# EAGLE design AFM_Power_board__NEW_SMD (EAGLE 9.6.2)
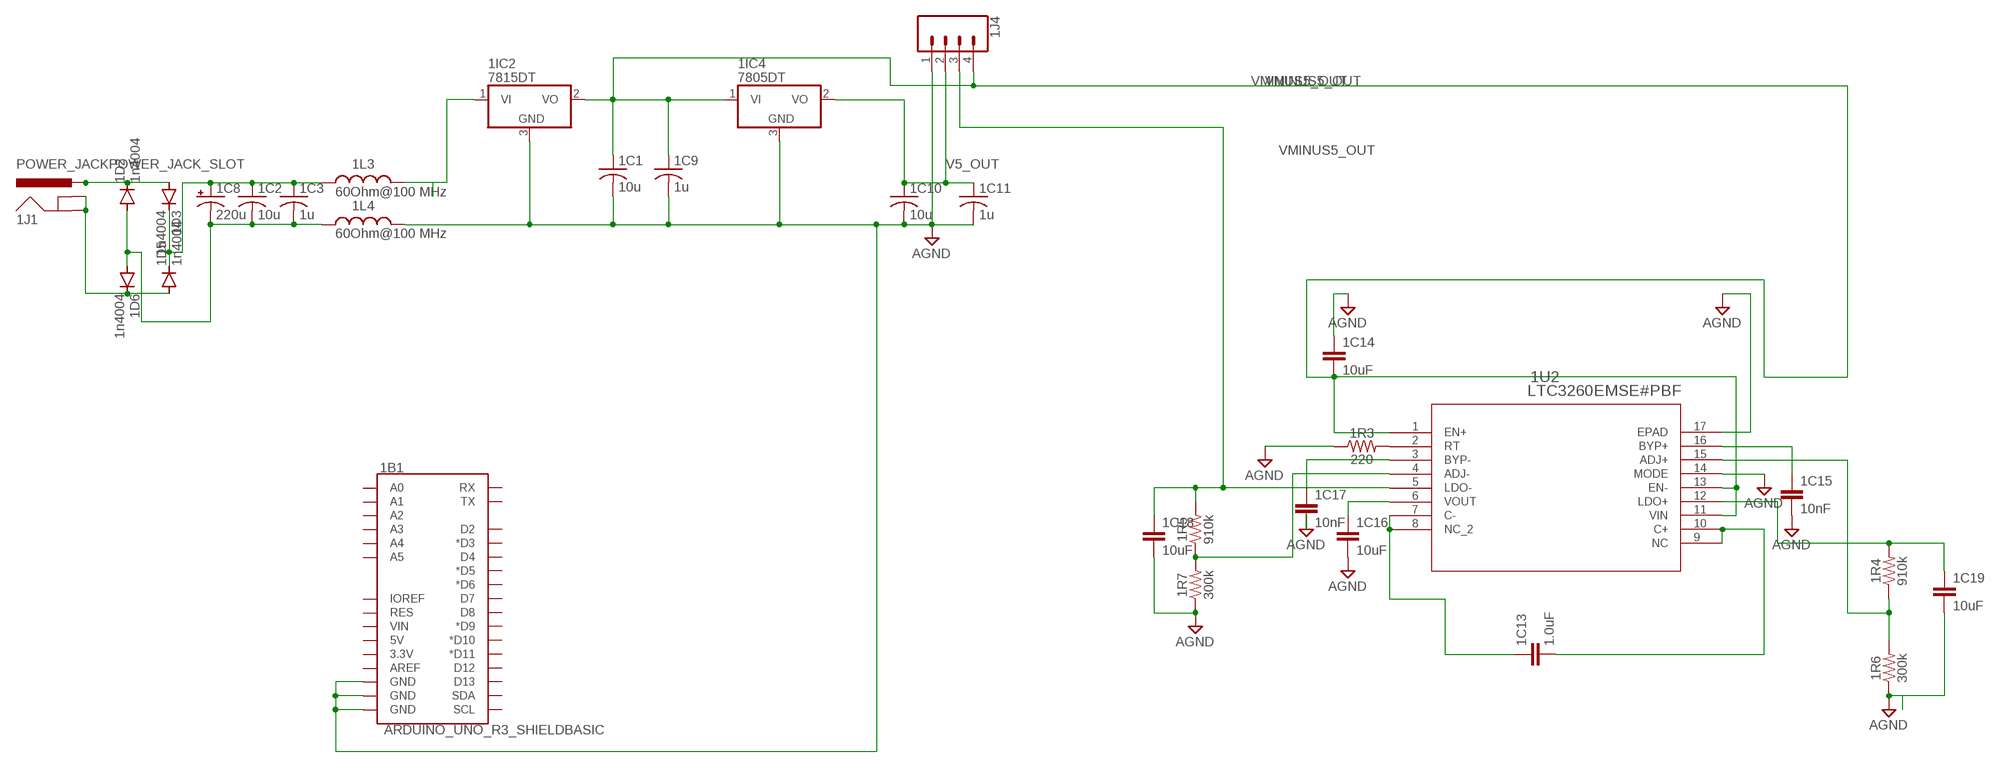
[diagram p0: schematic, sheet 1]

## Parts
1B1  ARDUINO_UNO_R3_SHIELDBASIC  [UNO_R3_SHIELD]
1C1  10u  C-USC0603  [C0603]
1C2  10u  C-USC1210  [C1210]
1C3  1u  C-USC1210  [C1210]
1C8  220u  CAPACITOR-P140CLH-1014  [140CLH-1014]
1C9  1u  C-USC0603  [C0603]
1C10  10u  C-USC0603  [C0603]
1C11  1u  C-USC0603  [C0603]
1C13  1.0uF  1.0UF-0805-25V-(+80/-20%)  [0805]
1C14  10uF  10UF-0805-25V-10%  [0805]
1C15  10nF  10NF-0603-50V-10%  [0603]
1C16  10uF  10UF-0805-25V-10%  [0805]
1C17  10nF  10NF-0603-50V-10%  [0603]
1C18  10uF  10UF-0805-25V-10%  [0805]
1C19  10uF  10UF-0805-25V-10%  [0805]
1D2  1n4004  DIODE-SOD123  [SOD123]
1D3  1n4004  DIODE-SOD123  [SOD123]
1D5  1n4004  DIODE-SOD123  [SOD123]
1D6  1n4004  DIODE-SOD123  [SOD123]
1IC2  7815DT  [TO252]
1IC4  7805DT  [TO252]
1J1  POWER_JACKPOWER_JACK_SLOT  [POWER_JACK_PTH_SLOT]
1J4  CONN_04LONGPADS  [1X04_LONGPADS]
1L3  60Ohm@100 MHz  WE-CBF_0603_74279267_WB_HS  [WE-CBF_0603_W2.2]
1L4  60Ohm@100 MHz  WE-CBF_0603_74279267_WB_HS  [WE-CBF_0603_W2.2]
1R3  220  220OHM-0603-1/10W-1%  [0603]
1R4  910k  100KOHM-0603-1/10W-1%  [0603]
1R5  910k  100KOHM-0603-1/10W-1%  [0603]
1R6  300k  300KOHM-0603-1/10W-1%  [0603]
1R7  300k  300KOHM-0603-1/10W-1%  [0603]
1U2  LTC3260EMSE#PBF  [MSOP-16_MSE]

## Nets
AGND: 1B1.GND@0(GND) 1B1.GND@1(GND) 1B1.GND@2(GND) 1C1.2 1C9.2 1C10.2 1C11.2 1C14.1 1C15.2 1C16.2 1C17.2 1C18.2 1C19.2 1IC2.3(GND) 1IC4.3(GND) 1J4.1 1L4.2 1R3.1 1R6.1 1R7.1 1U2.14(MODE) 1U2.17(EPAD)
GROUND: 1C2.2 1C3.2 1C8.- 1D2.A 1D6.A 1L4.1
LDO+: 1C19.1 1R4.2 1U2.12(LDO+)
N$2: 1D5.A 1D6.C 1J1.GND 1J1.GNDBREAK
N$5: 1IC2.1(VI) 1L3.2
N$6: 1C13.1 1U2.7(C-) 1U2.8(NC_2)
N$7: 1C13.2 1U2.9(NC) 1U2.10(C+)
N$11: 1C2.1 1C3.1 1C8.+ 1D3.C 1D5.C 1L3.1
N$12: 1C17.1 1U2.3(BYP-)
N$13: 1C15.1 1U2.16(BYP+)
N$14: 1C16.1 1U2.6(VOUT)
N$15: 1R3.2 1U2.2(RT)
N$16: 1R5.1 1R7.2 1U2.4(ADJ-)
N$17: 1R4.1 1R6.2 1U2.15(ADJ+)
POWERP: 1D2.C 1D3.A 1J1.PWR
V5_OUT: 1C10.1 1C11.1 1IC4.2(VO) 1J4.2
V15+: 1C1.1 1C9.1 1C14.2 1IC2.2(VO) 1IC4.1(VI) 1J4.4 1U2.1(EN+) 1U2.11(VIN) 1U2.13(EN-)
VMINUS5_OUT: 1C18.1 1J4.3 1R5.2 1U2.5(LDO-)
Unconnected: 1B1.3.3V 1B1.5V 1B1.A0 1B1.A1 1B1.A2 1B1.A3 1B1.A4 1B1.A5 1B1.AREF 1B1.D2 1B1.D3(*D3) 1B1.D4 1B1.D5(*D5) 1B1.D6(*D6) 1B1.D7 1B1.D8 1B1.D9(*D9) 1B1.D10(*D10) 1B1.D11(*D11) 1B1.D12 1B1.D13 1B1.IOREF 1B1.RES 1B1.RX 1B1.SCL 1B1.SDA 1B1.TX 1B1.VIN

## Library data of the parts
1B1 = SparkFun-Boards:ARDUINO_UNO_R3_SHIELD: Arduino R3 Shield Footprint Shield form compatible with the Arduino Uno R3. SparkFun Products: MG2639 Cellular Shield <https://www.sparkfun.com/products/13120> MIDI Shield <https://www.sparkfun.com/products/12898> R3 Stackable Headers Kit <https://www.sparkfun.com/products/11417>
1C1-1C3 1C9-1C11 = adafruit:C-US: CAPACITOR, American symbol
1C8 = BeagleBone_Blue_R3:CAPACITOR-P: POLARIZED CAPACITOR, American symbol
1C13 = SparkFun-Capacitors:1.0UF: 1µF ceramic capacitors A capacitor is a passive two-terminal electrical component used to store electrical energy temporarily in an electric field.; PROD_ID: CAP-11625
1C14 1C16 1C18 1C19 = SparkFun-Capacitors:10UF: 10.0µF ceramic capacitors A capacitor is a passive two-terminal electrical component used to store electrical energy temporarily in an electric field.; PROD_ID: CAP-14259
1C15 1C17 = SparkFun-Capacitors:10NF: 0.01uF/10nF/10,000pF ceramic capacitors A capacitor is a passive two-terminal electrical component used to store electrical energy temporarily in an electric field. CAP-09321; PROD_ID: CAP-00867
1D2 1D3 1D5 1D6 = diode:DIODE-: DIODE
1IC2 1IC4 = adafruit:78*: Positive VOLTAGE REGULATOR Added bigger pads to the TO-92 package
1J1 = SparkFun-Connectors:POWER_JACK: Power Jack Connector This is the standard 5.5mm barrel jack for power. The PTH is the most common, proven, reliable, footprint. The Slot footprint only works if the mill layer is transmitted to the PCB fab house so be warned. Here are the connectors we sell at SparkFun: DC Barrel Power Jack/Connector <https://www.sparkfun.com/products/119> (PRT-00119) DC Barrel Power Jack/Connector (SMD) <https://www.sparkfun.com/products/12748> (PRT-12748) DC Barrel Jack Adapter - Breadboard Compatible <https://www.sparkfun.com/products/10811> (PRT-10811) It is used on this SparkFun product (and many, many others): SparkFun RedBoard - Programmed with Arduino <https://www.sparkfun.com/products/12757> (DEV-12757) Also, if you need a mating power supply or connector, please check these out: Wall Adapter Power Supply - 9VDC 650mA <https://www.sparkfun.com/products/298> (TOL-00298) DC Barrel Jack Adapter - Male <https://www.sparkfun.com/products/10287> (PRT-10287); PROD_ID: CONN-08197
1J4 = SparkFun-Connectors:CONN_04: Multi connection point. Often used as Generic Header-pin footprint for 0.1 inch spaced/style header connections On any of the 0.1 inch spaced packages, you can populate with these: Break Away Headers - Straight <https://www.sparkfun.com/products/116> (PRT-00116) Break Away Male Headers - Right Angle <https://www.sparkfun.com/products/553> (PRT-00553) Female Headers <https://www.sparkfun.com/products/115> (PRT-00115) Break Away Headers - Machine Pin <https://www.sparkfun.com/products/117> (PRT-00117) Break Away Female Headers - Swiss Machine Pin <https://www.sparkfun.com/products/743> (PRT-00743) For SCREWTERMINALS and SPRING TERMINALS visit here: Screw Terimnals on SparkFun.com <https://www.sparkfun.com/search/results?term=Screw+Terminals> (5mm/3.5mm/2.54mm spacing) This device is also useful as a general connection point to wire up your design to another part of your project. Our various solder wires solder well into these plated through hole pads. Hook-Up Wire - Assortment (Stranded, 22 AWG) <https://www.sparkfun.com/products/11375> (PRT-11375) Hook-Up Wire - Assortment (Solid Core, 22 AWG) <https://www.sparkfun.com/products/11367> (PRT-11367) View the entire wire category on our website here <https://www.sparkfun.com/categories/141> Special notes: Molex polarized connector foot print use with SKU : PRT-08231 with associated crimp pins and housings. 1MM SMD Version SKU: PRT-10208; PROD_ID: CONN-09696
1L3 1L4 = Wurth_EMC Components_WE-CBF:WE-CBF_0603: WE-CBF SMD EMI Suppression Ferrite Bead Characteristics Reliable Ni-Sn electrodes High rated current up to 6 A Operating temperature: –55 ºC to +125 ºC Applications Perfect as data lined filter and for uncoupling of distribution voltage Package name and Variant abbreviation: Package: Wide Band /High Speed: W=Width= 2.2 High Current: W=Width= 2.6 Variant abbreviation: WB = Wide Band HS=High Speed HC=High Current <https://www.we-online.com/catalog/media/o14753v209%20Family_WE-CBF.jpg> Details see: www.we-online.com/katalog/WE-CBF <www.we-online.com/catalog/WE-CBF/?utm_source=eagle_model&utm_medium=description_link&utm_campaign=eisos_eagle> Updated by Ella Wu 2022-11-02 2022(C) Wurth Elektronik; DATASHEET-URL: https://www.we-online.com/redexpert/spec/74279267?ae; IR2: 2000mA; MOUNT: SMT; PART-NUMBER: 74279267; RDC-MAX: 0.3Ohm; TYPE: High Speed; Z-MAX: 110Ohm@650 MHz
1R3 = SparkFun-Resistors:220OHM: 220Ω resistor A resistor is a passive two-terminal electrical component that implements electrical resistance as a circuit element. Resistors act to reduce current flow, and, at the same time, act to lower voltage levels within circuits. - Wikipedia; PROD_ID: RES-07861
1R4 1R5 = SparkFun-Resistors:100KOHM: 100kΩ resistor A resistor is a passive two-terminal electrical component that implements electrical resistance as a circuit element. Resistors act to reduce current flow, and, at the same time, act to lower voltage levels within circuits. - Wikipedia; PROD_ID: RES-07828; VALUE: 100k
1R6 1R7 = SparkFun-Resistors:300KOHM: 300kΩ resistor A resistor is a passive two-terminal electrical component that implements electrical resistance as a circuit element. Resistors act to reduce current flow, and, at the same time, act to lower voltage levels within circuits. - Wikipedia; PROD_ID: RES-10809
1U2 = LTC3260EMSE_PBF (1):LTC3260EMSE#PBF: Check availability <https://pricing.snapeda.com/parts/LTC3260EMSE%23PBF/Analog%20Devices/view-part?ref=eda>; AVAILABILITY: In Stock; CHECK_PRICES: https://www.snapeda.com/parts/LTC3260EMSE%23PBF/Analog+Devices/view-part/?ref=eda; DESCRIPTION: Low Noise Dual Supply Inverting Charge Pump; MF: Analog Devices; MP: LTC3260EMSE#PBF; PACKAGE: MSOP -16 Analog Devices; PRICE: None; PURCHASE-URL: https://www.snapeda.com/api/url_track_click_mouser/?unipart_id=4339513&manufacturer=Analog Devices&part_name=LTC3260EMSE#PBF&search_term=None; SNAPEDA_LINK: https://www.snapeda.com/parts/LTC3260EMSE%23PBF/Analog+Devices/view-part/?ref=snap

## Board
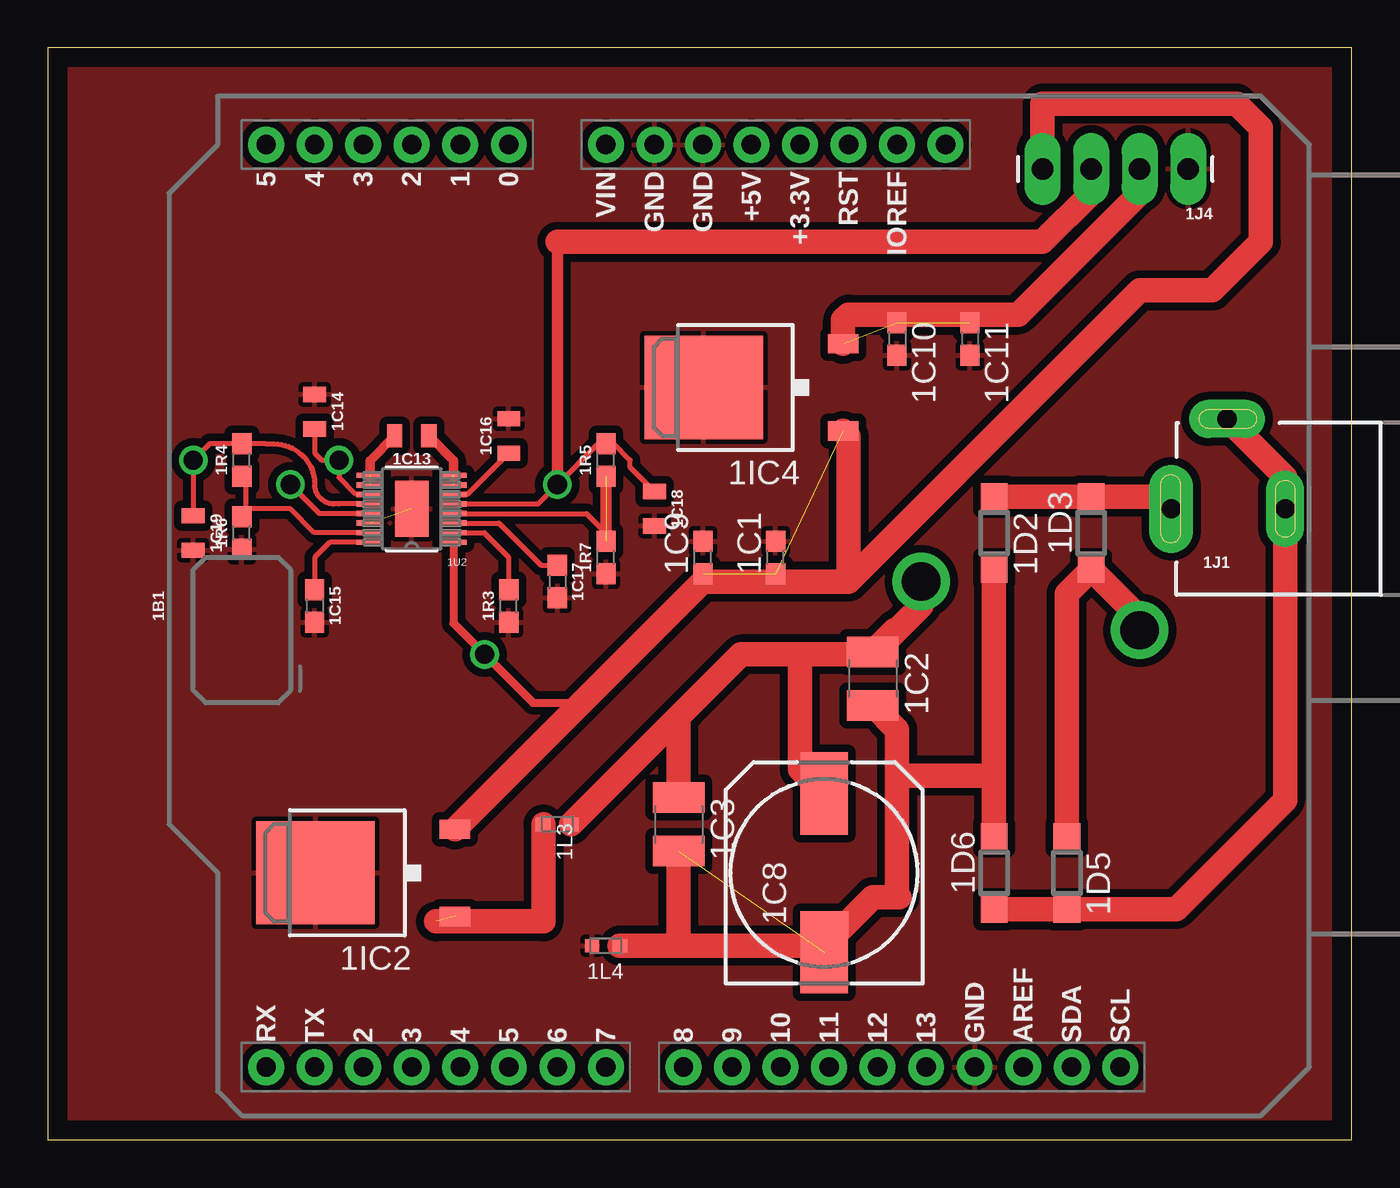
[diagram p1: board, top side]
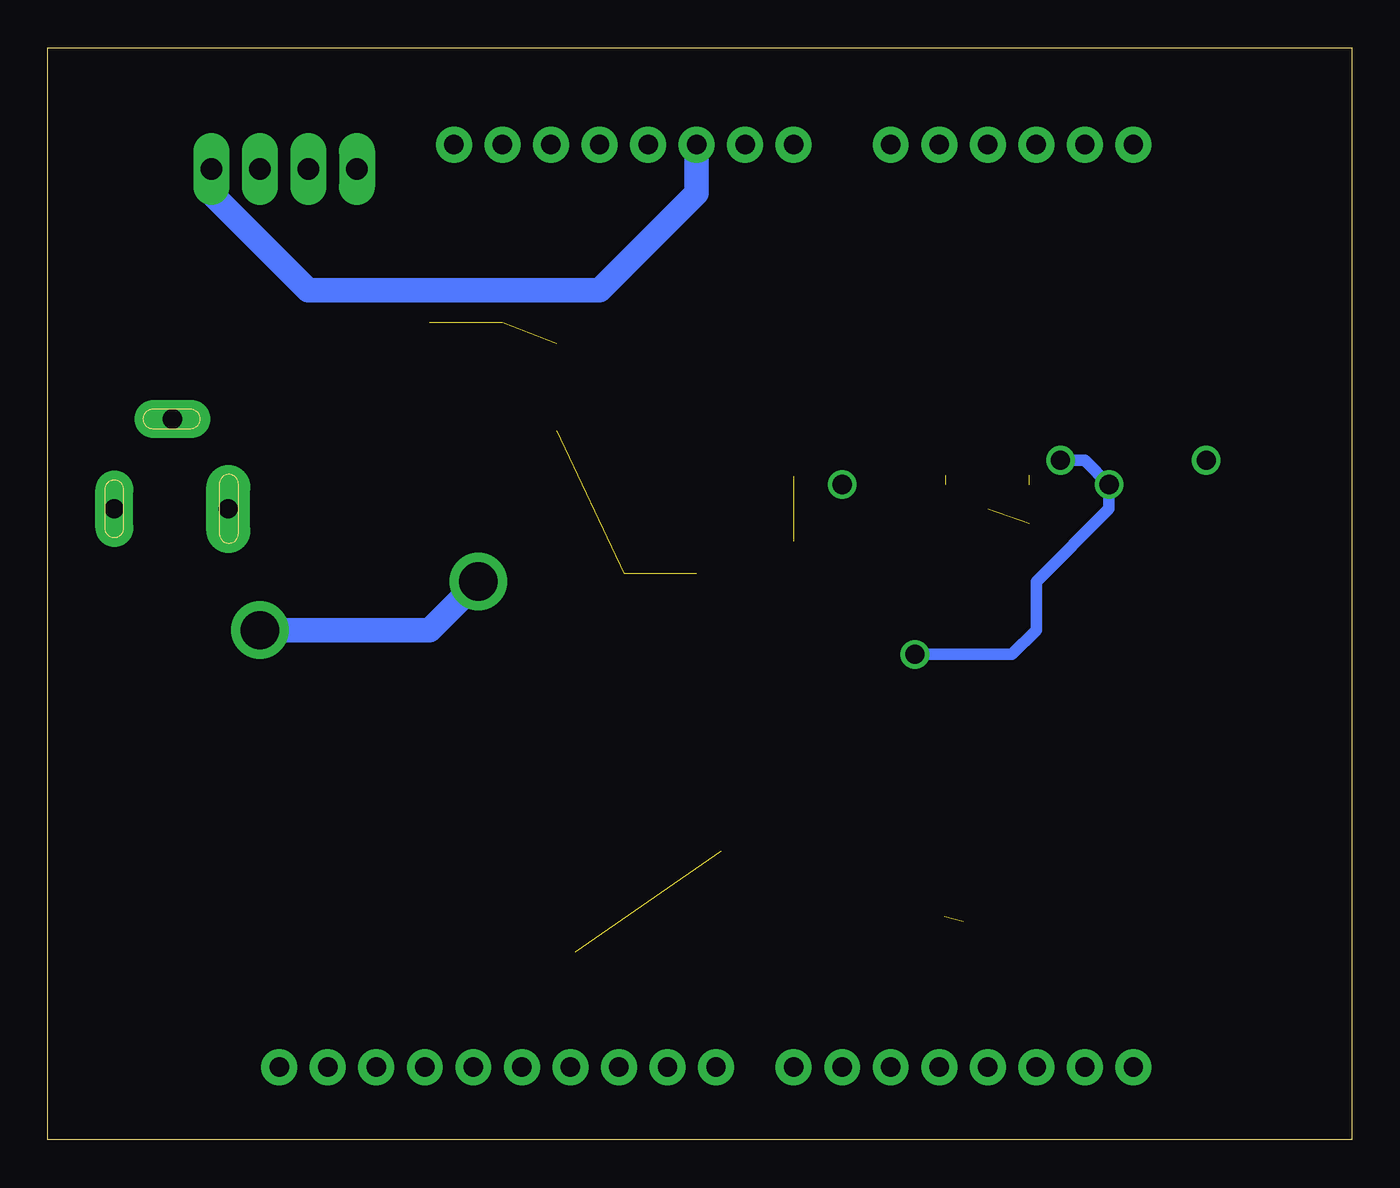
[diagram p2: board, bottom side, seen from below]

Size 68.25 x 57.14 mm. Coordinates in mm from the lower left corner, seen from the top.
Outline: 0,0 68.25,0 68.25,57.14 0,57.14 0,0
Copper layers (1*16): Top 0.035mm / dielectric 1.5mm / Bottom 0.035mm
Design rules "default": minimum track width 6mil, minimum drill 0.35mm, track to track 6mil, track to pad 6mil, pad to pad 6mil, via to via 6mil, smd to smd 6mil, copper to edge 40mil, drill to drill 6mil, minimum pad ring 10mil, minimum via ring 8mil, stop-mask expansion 4mil, vias tented up to drill 0mil, thermal gap 10mil

### Footprints (pad centres in the part's own frame; a part is rotated, then mirrored left to right if it is on the bottom)
UNO_R3_SHIELD = drill 1.016 pad 1.88: 3.3V 24.13,-2.54; 5V 24.13,0; A0 24.13,12.7; A1 24.13,15.24; A2 24.13,17.78; A3 24.13,20.32; A4 24.13,22.86; A5 24.13,25.4; AREF -24.13,-14.224; D2 -24.13,20.32; D3 -24.13,17.78; D4 -24.13,15.24; D5 -24.13,12.7; D6 -24.13,10.16; D7 -24.13,7.62; D8 -24.13,3.556; D9 -24.13,1.016; D10 -24.13,-1.524; D11 -24.13,-4.064; D12 -24.13,-6.604; D13 -24.13,-9.144; GND@0 24.13,2.54; GND@1 24.13,5.08; GND@2 -24.13,-11.684; IOREF 24.13,-7.62; NC 24.13,-10.16; RES 24.13,-5.08; RX -24.13,25.4; SCL -24.13,-19.304; SDA -24.13,-16.764; TX -24.13,22.86; VIN 24.13,7.62
C0603 = smd 1.1 x 1: 1 -0.85,0; 2 0.85,0
C1210 = smd 1.6 x 2.7: 1 -1.4,0; 2 1.4,0
140CLH-1014 = smd 4.3 x 2.5: + 4.15,0; - -4.15,0
0805 = smd 0.8 x 1.2: 1 -0.9,0; 2 0.9,0
0603 = smd 1.1 x 1: 1 -0.85,0; 2 0.85,0
SOD123 = smd 1.4 x 1.4: A 1.9,0; C -1.9,0
TO252 = smd 1 x 1.6: 1 -2.28,-4.8; 2 2.28,-4.8 | smd 5.4 x 6.2: 3 0,2.5
POWER_JACK_PTH_SLOT = drill 1 pad 2 long: GND 0,0; GNDBREAK -3.048,4.699 | drill 1 pad 2.3 long: PWR -5.969,0
1X04_LONGPADS = drill 1.118 pad 1.88 long: 1 0,0; 2 2.54,0; 3 5.08,0; 4 7.62,0
WE-CBF_0603_W2.2 = smd 0.75 x 0.7: 1 -0.725,0; 2 0.725,0
MSOP-16_MSE = smd 1.397 x 0.279: 1 -2.184,1.751; 2 -2.184,1.251; 3 -2.184,0.751; 4 -2.184,0.25; 5 -2.184,-0.25; 6 -2.184,-0.751; 7 -2.184,-1.251; 8 -2.184,-1.751; 9 2.184,-1.751; 10 2.184,-1.251; 11 2.184,-0.751; 12 2.184,-0.25; 13 2.184,0.25; 14 2.184,0.751; 15 2.184,1.251; 16 2.184,1.751 | smd 1.753 x 2.946: 17 0,0

### Placement (x,y rotation side)
1B1  36.83,27.94 90 top
1C1  38.1,30.48 90 top
1C2  43.18,24.13 270 top
1C3  33.02,16.51 270 top
1C8  40.64,13.97 90 top
1C9  34.29,30.48 90 top
1C10  44.45,41.91 270 top
1C11  48.26,41.91 270 top
1C13  19.05,36.83 180 top
1C14  13.97,38.1 270 top
1C15  13.97,27.94 270 top
1C16  24.13,36.83 90 top
1C17  26.67,29.21 270 top
1C18  31.75,33.02 270 top
1C19  7.62,31.75 270 top
1D2  49.53,31.75 270 top
1D3  54.61,31.75 90 top
1D5  53.34,13.97 270 top
1D6  49.53,13.97 90 top
1IC2  16.51,13.97 90 top
1IC4  36.83,39.37 90 top
1J1  64.77,33.02 0 top
1J4  59.69,50.8 180 top
1L3  26.67,16.51 180 top
1L4  29.21,10.16 180 top
1R3  24.13,27.94 90 top
1R4  10.16,35.56 90 top
1R5  29.21,35.56 90 top
1R6  10.16,31.75 90 top
1R7  29.21,30.48 90 top
1U2  19.05,33.02 180 top

### Tracks (layer width: path | path; a pad name or v marks a point on that pad's centre or on a via)
AGND  (1 unrouted)
  Bottom 1.27: 1J4.1 59.69,49.53 54.61,44.45 39.37,44.45 34.29,49.53 1B1.GND@0
  pour Top (isolate 0.406, rank 6): 0,57.15 68.58,57.15 68.58,0 0,0
GROUND  (1 unrouted)
  Top 1.27: 1D2.A 49.53,19.05 | 49.53,19.05 1D6.A | 1C2.2 44.45,21.46 44.45,19.05 | 44.45,19.05 44.45,12.83 44.58,12.7 43.18,12.7 40.64,10.16 33.02,10.16 | 33.02,10.16 1C3.2 | 33.02,10.16 1L4.1 | 49.53,19.05 44.45,19.05
LDO+  (via drill 1)
  Top 0.254: 1U2.12 15.24,33.27 14.99,33.27 arc-90 13.97,34.29 arc90 11.85,36.41 11.43,36.41 1R4.2 8.47,36.41 v7.62,35.56 1C19.1
N$2
  Top 1.27: 1D6.C 1D5.A 59.06,12.07 64.77,17.78 1J1.GND 64.77,34.67 1J1.GNDBREAK
N$5  (1 unrouted)
  Top 1.27: 1L3.2 25.95,11.43 20.32,11.43
N$6  (2 unrouted)
  Top 0.508: 1C13.1 21.23,35.55 21.23,34.32
N$7  (2 unrouted)
  Top 0.508: 1C13.2 16.87,35.55 16.87,34.32
N$11  (via drill 2)
  Top 1.27: 1D5.C 53.34,28.58 1D3.C 57.15,27.31 v57.15,26.67 | v45.72,29.21 45.72,27.94 44.45,26.67 | 44.45,26.67 43.18,25.4 39.37,25.4 | 39.37,25.4 36.28,25.4 33.38,22.5 | 33.38,22.5 1L3.1 | 1C2.1 44.32,26.67 44.45,26.67 | 1C8.+ 39.37,19.39 39.37,25.4 | 1C3.1 33.02,22.14 33.38,22.5
  Bottom 1.27: v57.15,26.67 48.26,26.67 v45.72,29.21
N$12
  Top 0.254: 1U2.3 23.61,32.27 25.82,30.06 1C17.1
N$13
  Top 0.254: 1U2.16 14.76,31.27 13.97,30.48 1C15.1
N$14
  Top 0.254: 1U2.6 21.25,33.78 21.98,33.78 1C16.1
N$15
  Top 0.254: 1U2.2 22.84,31.77 24.13,30.48 1R3.2
N$16  (1 unrouted)
  Top 0.254: 1U2.4 28.19,32.77 29.21,31.75
  Top 0.61: 1R5.1 29.21,31.75
N$17
  Top 0.254: 1U2.15 13.95,31.77 12.7,33.02 10.58,33.02 10.37,32.81 | 10.37,32.81 1R6.2 | 1R4.1 10.37,34.5 10.37,32.81
POWERP
  Top 1.27: 1D2.C 1D3.A 58.17,33.65 1J1.PWR
V5_OUT  (2 unrouted)
  Top 1.27: 1IC4.2 41.63,42.9 41.91,43.18 50.8,43.18 57.15,49.53 1J4.2
V15+  (via drill 1)  (2 unrouted)
  Top 0.254: 1U2.11 16.85,33.78 16.12,33.78 15.24,34.66 v15.24,35.56 14.34,35.56 13.97,35.93 1C14.2 | 1U2.13 14.22,32.77 v12.7,34.29
  Top 0.406: 1U2.1 21.23,27.03 v22.86,25.4 25.39,22.87 27.93,22.87
  Top 1.27: 41.91,29.21 34.27,29.21 27.93,22.87 1IC2.2 | 41.91,29.21 57.15,44.45 60.96,44.45 63.5,46.99 63.5,52.95 62.23,54.22 52.07,54.22 1J4.4 | 1IC4.1 41.91,36.81 41.91,29.21
  Bottom 0.61: v22.86,25.4 17.78,25.4 16.51,26.67 16.51,29.21 12.7,33.02 v12.7,34.29 13.97,35.56 v15.24,35.56
VMINUS5_OUT  (via drill 1)
  Top 0.254: 1C18.1 30.48,35.19 30.48,35.56 29.63,36.41 1R5.2 28.79,36.41 v26.67,34.29 25.65,33.27 1U2.5
  Top 0.61: v26.67,34.29 26.67,46.99
  Top 1.27: 1J4.3 54.61,49.53 52.07,46.99 26.67,46.99